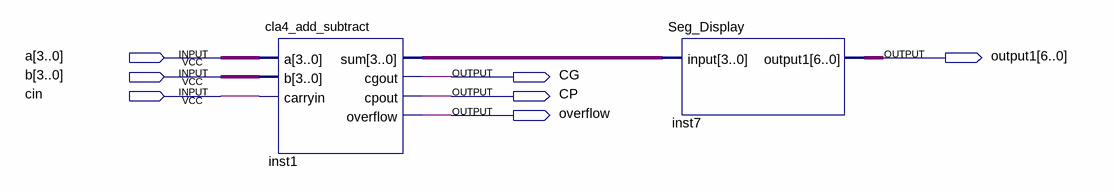
[diagram p0: schematic sheet]
// Quartus schematic Block1.bdf as structural Verilog: 2 symbols, 7 pins
module Block1 (
  input  [3:0] a,
  input  [3:0] b,
  input  cin,
  output [6:0] output1,
  output CG,
  output CP,
  output overflow
);

  wire [3:0] inst1_sum;

  cla4_add_subtract inst1 (.a(a), .b(b), .carryin(cin), .sum(inst1_sum), .cgout(CG), .cpout(CP), .overflow(overflow));
  Seg_Display inst7 (.\input (inst1_sum), .output1(output1));
endmodule
